# Altium schematic sheet Relay_ClockLed.SchDoc
size A4; SheetNumber: 6; SheetTotal: 8
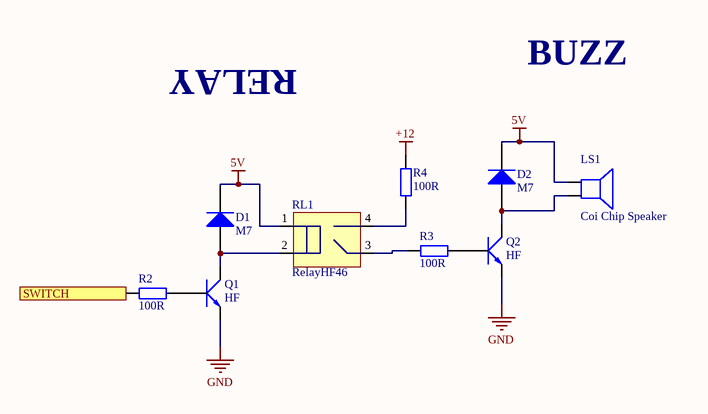
[diagram p0: Relay_ClockLed.SchDoc]

## Parts
D1  M7  [DIODE SMA]
D2  M7  [DIODE SMA]
LS1  Coi Chip Speaker  [Coi Chip Speacker]
Q1  HF  [SOT23]
Q2  HF  [SOT23]
R2  100R  [tro smd 0805]
R3  100R  [tro smd 0805]
R4  100R  [tro smd 0805]
RL1  RelayHF46  [Relay 4 chan HF46F]

## Ports
SWITCH

## Nets
5V: D1.2(K) D2.2(K) LS1.1 RL1.1
+12: R4.2
GND: Q1.2(E) Q2.2(E)
SWITCH: R2.1 ; port SWITCH
NetD1_1: D1.1(A) Q1.3(C) RL1.2
NetD2_1: D2.1(A) LS1.2 Q2.3(C)
NetQ1_1: Q1.1(B) R2.2
NetQ2_1: Q2.1(B) R3.2
NetR3_1: R3.1 RL1.3(AC/DC)
NetR4_1: R4.1 RL1.4(AC/DC)

## Notes on the sheet
- RELAY
- BUZZ

## Library data of the parts
D1 D2 = Diode M7 ( 4007 ): Dán; Don_Vi: Con; Ten_Linh_Kien: Diode M7 1N4007 SMD 1A 1000V; Ma_Hang: MH000944; Chung_Loai: Dán; Ghi_Chu: *
LS1 = Coi Chip Speaker: Còi chip
Q1 Q2 = C1815 HF SMD: NPN transistor; Value: C9014
R2-R4 = Tro 0805 5% 100R: Dán; Don_Vi: Con; So_Chan: 2; Ten_Linh_Kien: Trở 0805 5% 100R; Ma_Hang: MH005251; Chung_Loai: Dán; Kieu_Chan: *
RL1 = Relay 4 chan HF46F: Ten: Relay 5V5A HF46F-G 5-HS1; Ma_Hang: MH003879